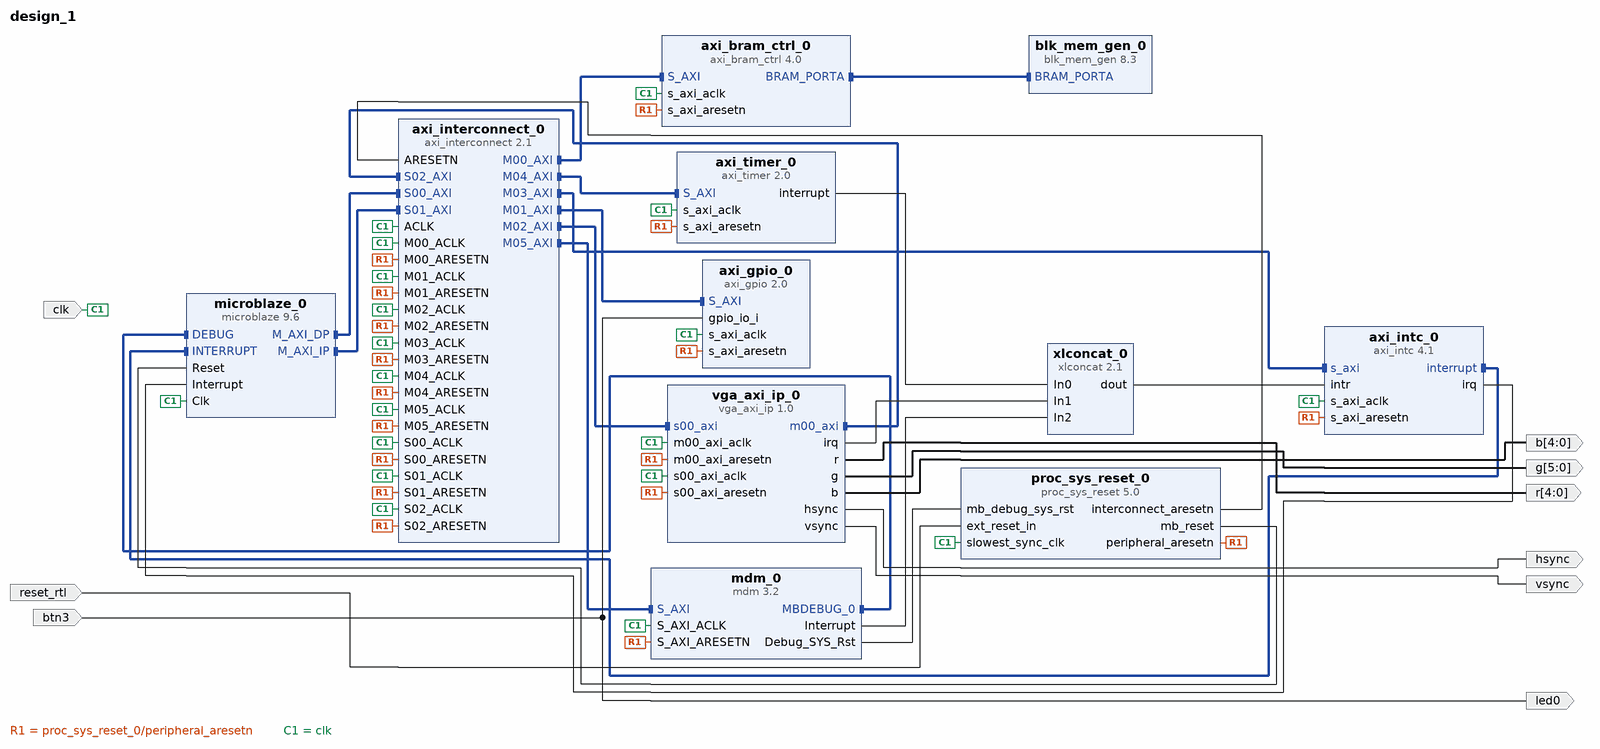
[diagram p0: block diagram of the top level]
# Vivado block design design_1, Vivado 2016.2
create_bd_design design_1

create_bd_port -dir O -from 4 -to 0 r
create_bd_port -dir O -from 5 -to 0 g
create_bd_port -dir O -from 4 -to 0 -type clk b
create_bd_port -dir I -type rst reset_rtl
set_property -dict {CONFIG.POLARITY ACTIVE_HIGH} [get_bd_ports reset_rtl]
create_bd_port -dir O hsync
create_bd_port -dir I -type clk clk
set_property -dict {CONFIG.FREQ_HZ 125000000} [get_bd_ports clk]
create_bd_port -dir I btn3
create_bd_port -dir O led0
create_bd_port -dir O vsync

create_bd_cell -type ip -vlnv xilinx.com:ip:xlconcat:2.1 xlconcat_0
set_property -dict {CONFIG.NUM_PORTS 3} [get_bd_cells xlconcat_0]
create_bd_cell -type ip -vlnv xilinx.com:ip:axi_bram_ctrl:4.0 axi_bram_ctrl_0
set_property -dict {CONFIG.SINGLE_PORT_BRAM 1} [get_bd_cells axi_bram_ctrl_0]
create_bd_cell -type ip -vlnv xilinx.com:ip:axi_gpio:2.0 axi_gpio_0
set_property -dict {CONFIG.C_GPIO_WIDTH 1 CONFIG.C_ALL_INPUTS 0} [get_bd_cells axi_gpio_0]
create_bd_cell -type ip -vlnv xilinx.com:ip:axi_intc:4.1 axi_intc_0
set_property -dict [list \
  CONFIG.C_HAS_IPR 1 \
  CONFIG.C_HAS_SIE 0 \
  CONFIG.C_HAS_CIE 0 \
  CONFIG.C_HAS_IVR 0 \
  CONFIG.C_HAS_FAST 0 \
] [get_bd_cells axi_intc_0]
create_bd_cell -type ip -vlnv xilinx.com:ip:axi_interconnect:2.1 axi_interconnect_0
set_property -dict {CONFIG.NUM_SI 3 CONFIG.NUM_MI 6} [get_bd_cells axi_interconnect_0]
create_bd_cell -type ip -vlnv xilinx.com:ip:axi_timer:2.0 axi_timer_0
set_property -dict {CONFIG.enable_timer2 0} [get_bd_cells axi_timer_0]
create_bd_cell -type ip -vlnv xilinx.com:ip:blk_mem_gen:8.3 blk_mem_gen_0
create_bd_cell -type ip -vlnv xilinx.com:ip:mdm:3.2 mdm_0
set_property -dict {CONFIG.C_USE_UART 1} [get_bd_cells mdm_0]
create_bd_cell -type ip -vlnv xilinx.com:ip:microblaze:9.6 microblaze_0
set_property -dict [list \
  CONFIG.C_D_AXI 1 \
  CONFIG.C_D_LMB 0 \
  CONFIG.C_I_AXI 1 \
  CONFIG.C_I_LMB 0 \
  CONFIG.C_USE_REORDER_INSTR 0 \
  CONFIG.C_USE_ICACHE 0 \
  CONFIG.C_USE_DCACHE 0 \
] [get_bd_cells microblaze_0]
create_bd_cell -type ip -vlnv xilinx.com:ip:proc_sys_reset:5.0 proc_sys_reset_0
create_bd_cell -type ip -vlnv user.org:user:vga_axi_ip:1.0 vga_axi_ip_0

# ---- connections ----

connect_bd_intf_net [get_bd_intf_pins axi_bram_ctrl_0/BRAM_PORTA] [get_bd_intf_pins blk_mem_gen_0/BRAM_PORTA]
connect_bd_intf_net [get_bd_intf_pins axi_interconnect_0/M00_AXI] [get_bd_intf_pins axi_bram_ctrl_0/S_AXI]
connect_bd_intf_net [get_bd_intf_pins microblaze_0/M_AXI_DP] [get_bd_intf_pins axi_interconnect_0/S00_AXI]
connect_bd_intf_net [get_bd_intf_pins microblaze_0/M_AXI_IP] [get_bd_intf_pins axi_interconnect_0/S01_AXI]
connect_bd_intf_net [get_bd_intf_pins mdm_0/MBDEBUG_0] [get_bd_intf_pins microblaze_0/DEBUG]
connect_bd_intf_net [get_bd_intf_pins axi_timer_0/S_AXI] [get_bd_intf_pins axi_interconnect_0/M04_AXI]
connect_bd_intf_net [get_bd_intf_pins mdm_0/S_AXI] [get_bd_intf_pins axi_interconnect_0/M05_AXI]
connect_bd_intf_net [get_bd_intf_pins axi_intc_0/s_axi] [get_bd_intf_pins axi_interconnect_0/M03_AXI]
connect_bd_intf_net [get_bd_intf_pins axi_intc_0/interrupt] [get_bd_intf_pins microblaze_0/INTERRUPT]
connect_bd_intf_net [get_bd_intf_pins vga_axi_ip_0/m00_axi] [get_bd_intf_pins axi_interconnect_0/S02_AXI]
connect_bd_intf_net [get_bd_intf_pins axi_interconnect_0/M01_AXI] [get_bd_intf_pins axi_gpio_0/S_AXI]
connect_bd_intf_net [get_bd_intf_pins axi_interconnect_0/M02_AXI] [get_bd_intf_pins vga_axi_ip_0/s00_axi]
connect_bd_net [get_bd_pins mdm_0/Debug_SYS_Rst] [get_bd_pins proc_sys_reset_0/mb_debug_sys_rst]
connect_bd_net [get_bd_pins axi_timer_0/interrupt] [get_bd_pins xlconcat_0/In0]
connect_bd_net [get_bd_pins xlconcat_0/dout] [get_bd_pins axi_intc_0/intr]
connect_bd_net [get_bd_pins mdm_0/Interrupt] [get_bd_pins xlconcat_0/In2]
connect_bd_net [get_bd_pins proc_sys_reset_0/mb_reset] [get_bd_pins microblaze_0/Reset]
connect_bd_net [get_bd_pins proc_sys_reset_0/interconnect_aresetn] [get_bd_pins axi_interconnect_0/ARESETN]
connect_bd_net [get_bd_pins proc_sys_reset_0/peripheral_aresetn] \
  [get_bd_pins axi_bram_ctrl_0/s_axi_aresetn] [get_bd_pins axi_gpio_0/s_axi_aresetn] [get_bd_pins axi_intc_0/s_axi_aresetn] \
  [get_bd_pins axi_timer_0/s_axi_aresetn] [get_bd_pins mdm_0/S_AXI_ARESETN] [get_bd_pins vga_axi_ip_0/s00_axi_aresetn] \
  [get_bd_pins vga_axi_ip_0/m00_axi_aresetn] [get_bd_pins axi_interconnect_0/S00_ARESETN] \
  [get_bd_pins axi_interconnect_0/S01_ARESETN] [get_bd_pins axi_interconnect_0/S02_ARESETN] \
  [get_bd_pins axi_interconnect_0/M00_ARESETN] [get_bd_pins axi_interconnect_0/M01_ARESETN] \
  [get_bd_pins axi_interconnect_0/M02_ARESETN] [get_bd_pins axi_interconnect_0/M03_ARESETN] \
  [get_bd_pins axi_interconnect_0/M04_ARESETN] [get_bd_pins axi_interconnect_0/M05_ARESETN]
connect_bd_net [get_bd_pins vga_axi_ip_0/r] [get_bd_ports r]
connect_bd_net [get_bd_pins vga_axi_ip_0/g] [get_bd_ports g]
connect_bd_net [get_bd_pins vga_axi_ip_0/b] [get_bd_ports b]
connect_bd_net [get_bd_ports reset_rtl] [get_bd_pins proc_sys_reset_0/ext_reset_in]
connect_bd_net [get_bd_pins vga_axi_ip_0/hsync] [get_bd_ports hsync]
connect_bd_net [get_bd_ports clk] \
  [get_bd_pins axi_bram_ctrl_0/s_axi_aclk] [get_bd_pins axi_gpio_0/s_axi_aclk] [get_bd_pins axi_intc_0/s_axi_aclk] \
  [get_bd_pins axi_timer_0/s_axi_aclk] [get_bd_pins mdm_0/S_AXI_ACLK] [get_bd_pins microblaze_0/Clk] \
  [get_bd_pins proc_sys_reset_0/slowest_sync_clk] [get_bd_pins vga_axi_ip_0/s00_axi_aclk] \
  [get_bd_pins vga_axi_ip_0/m00_axi_aclk] [get_bd_pins axi_interconnect_0/ACLK] [get_bd_pins axi_interconnect_0/S00_ACLK] \
  [get_bd_pins axi_interconnect_0/S01_ACLK] [get_bd_pins axi_interconnect_0/S02_ACLK] \
  [get_bd_pins axi_interconnect_0/M00_ACLK] [get_bd_pins axi_interconnect_0/M01_ACLK] \
  [get_bd_pins axi_interconnect_0/M02_ACLK] [get_bd_pins axi_interconnect_0/M03_ACLK] \
  [get_bd_pins axi_interconnect_0/M04_ACLK] [get_bd_pins axi_interconnect_0/M05_ACLK]
connect_bd_net -net btn3_1 [get_bd_ports btn3] [get_bd_ports led0] [get_bd_pins axi_gpio_0/gpio_io_i]
connect_bd_net [get_bd_pins vga_axi_ip_0/irq] [get_bd_pins xlconcat_0/In1]
connect_bd_net [get_bd_pins axi_intc_0/irq] [get_bd_pins microblaze_0/Interrupt]
connect_bd_net [get_bd_pins vga_axi_ip_0/vsync] [get_bd_ports vsync]

# ---- address map ----
assign_bd_address -offset 0x00000000 -range 128K -target_address_space [get_bd_addr_spaces microblaze_0/Data] [get_bd_addr_segs axi_bram_ctrl_0/S_AXI/Mem0]
assign_bd_address -offset 0x40000000 -range 64K -target_address_space [get_bd_addr_spaces microblaze_0/Data] [get_bd_addr_segs axi_gpio_0/S_AXI/Reg]
assign_bd_address -offset 0x41200000 -range 64K -target_address_space [get_bd_addr_spaces microblaze_0/Data] [get_bd_addr_segs axi_intc_0/S_AXI/Reg]
assign_bd_address -offset 0x41400000 -range 4K -target_address_space [get_bd_addr_spaces microblaze_0/Data] [get_bd_addr_segs mdm_0/S_AXI/Reg]
assign_bd_address -offset 0x41C00000 -range 64K -target_address_space [get_bd_addr_spaces microblaze_0/Data] [get_bd_addr_segs axi_timer_0/S_AXI/Reg]
assign_bd_address -offset 0x73A00000 -range 64K -target_address_space [get_bd_addr_spaces microblaze_0/Data] [get_bd_addr_segs vga_axi_ip_0/s00_axi/reg0]
assign_bd_address -offset 0x00000000 -range 128K -target_address_space [get_bd_addr_spaces microblaze_0/Instruction] [get_bd_addr_segs axi_bram_ctrl_0/S_AXI/Mem0]
assign_bd_address -offset 0x40000000 -range 64K -target_address_space [get_bd_addr_spaces microblaze_0/Instruction] [get_bd_addr_segs axi_gpio_0/S_AXI/Reg]
assign_bd_address -offset 0x41200000 -range 64K -target_address_space [get_bd_addr_spaces microblaze_0/Instruction] [get_bd_addr_segs axi_intc_0/S_AXI/Reg]
assign_bd_address -offset 0x41400000 -range 4K -target_address_space [get_bd_addr_spaces microblaze_0/Instruction] [get_bd_addr_segs mdm_0/S_AXI/Reg]
assign_bd_address -offset 0x41C00000 -range 64K -target_address_space [get_bd_addr_spaces microblaze_0/Instruction] [get_bd_addr_segs axi_timer_0/S_AXI/Reg]
assign_bd_address -offset 0x73A00000 -range 64K -target_address_space [get_bd_addr_spaces microblaze_0/Instruction] [get_bd_addr_segs vga_axi_ip_0/s00_axi/reg0]
assign_bd_address -offset 0x00000000 -range 128K -target_address_space [get_bd_addr_spaces vga_axi_ip_0/m00_axi] [get_bd_addr_segs axi_bram_ctrl_0/S_AXI/Mem0]
assign_bd_address -offset 0x40000000 -range 64K -target_address_space [get_bd_addr_spaces vga_axi_ip_0/m00_axi] [get_bd_addr_segs axi_gpio_0/S_AXI/Reg]
assign_bd_address -offset 0x41200000 -range 64K -target_address_space [get_bd_addr_spaces vga_axi_ip_0/m00_axi] [get_bd_addr_segs axi_intc_0/S_AXI/Reg]
assign_bd_address -offset 0x41400000 -range 4K -target_address_space [get_bd_addr_spaces vga_axi_ip_0/m00_axi] [get_bd_addr_segs mdm_0/S_AXI/Reg]
assign_bd_address -offset 0x41C00000 -range 64K -target_address_space [get_bd_addr_spaces vga_axi_ip_0/m00_axi] [get_bd_addr_segs axi_timer_0/S_AXI/Reg]
assign_bd_address -offset 0x73A00000 -range 64K -target_address_space [get_bd_addr_spaces vga_axi_ip_0/m00_axi] [get_bd_addr_segs vga_axi_ip_0/s00_axi/reg0]

validate_bd_design
save_bd_design
